# Altium schematic sheet NB3000_Top.SchDoc: NB3000 Top Level
size A2; Organization: Altium Limited.; DocumentNumber: 3; Revision: 1; SheetNumber: 1; SheetTotal: 106
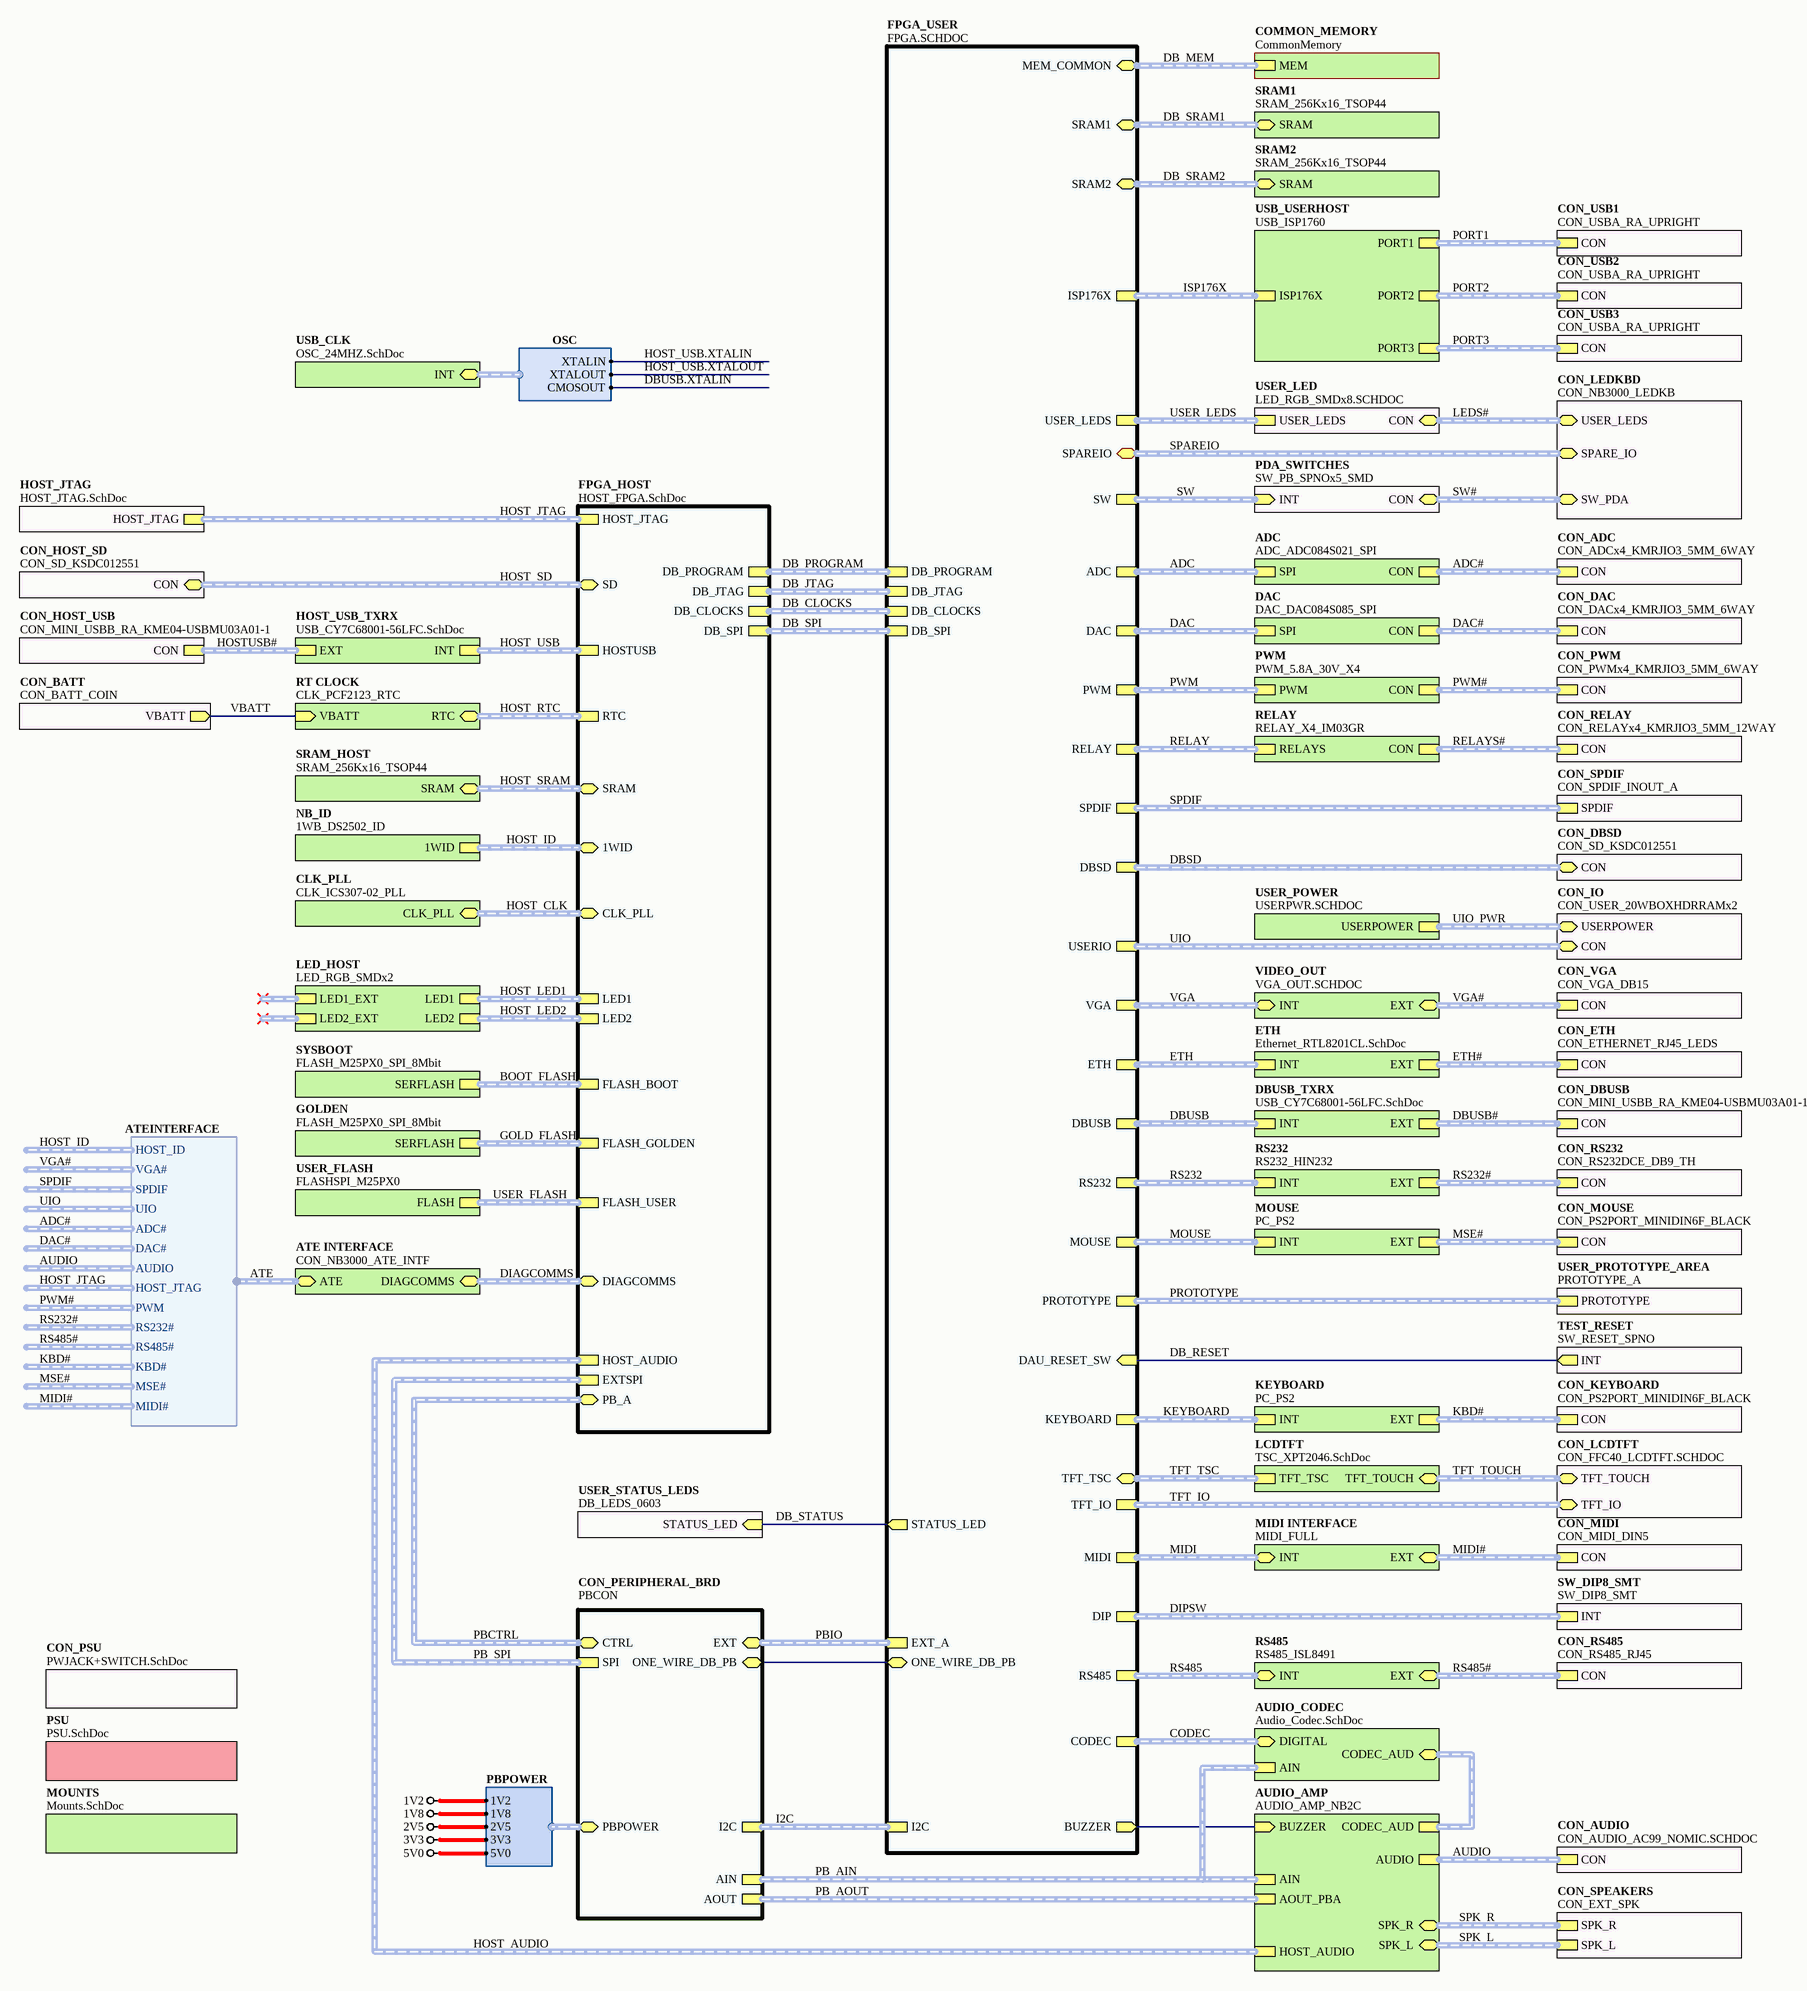
[diagram p0: NB3000_Top.SchDoc]

## Sub-sheets
ADC = ADC_ADC084S021_SPI: SPI (harness ADC_SPI), CON (harness ADC_CON)
ATE INTERFACE = CON_NB3000_ATE_INTF: ATE (harness ATEINTERFACE), DIAGCOMMS (harness DIAGCOMMS)
AUDIO_AMP = AUDIO_AMP_NB2C: BUZZER (in), CODEC_AUD (harness STEREO), AUDIO (harness AUDIO_EXT), SPK_L (harness SPEAKER), SPK_R (harness SPEAKER), HOST_AUDIO (harness STEREO), AIN (harness AUDIO_IN), AOUT_PBA (harness AUDIO_OUT)
AUDIO_CODEC = Audio_Codec.SchDoc: DIGITAL (harness AUDIO_DIGITAL), CODEC_AUD (harness STEREO), AIN (harness AUDIO_IN)
CLK_PLL = CLK_ICS307-02_PLL: CLK_PLL (harness CLK_PLL)
COMMON_MEMORY = CommonMemory: MEM (harness HOSTMEMORY)
CON_ADC = CON_ADCx4_KMRJIO3_5MM_6WAY: CON (harness ADC_CON)
CON_AUDIO = CON_AUDIO_AC99_NOMIC.SCHDOC: CON (harness AUDIO_EXT)
CON_BATT = CON_BATT_COIN: VBATT (out)
CON_DAC = CON_DACx4_KMRJIO3_5MM_6WAY: CON (harness DAC_CON)
CON_DBSD = CON_SD_KSDC012551: CON (harness SD)
CON_DBUSB = CON_MINI_USBB_RA_KME04-USBMU03A01-1: CON (harness USB_CON)
CON_ETH = CON_ETHERNET_RJ45_LEDS: CON (harness ETHERNET_CON)
CON_HOST_SD = CON_SD_KSDC012551: CON (harness SD)
CON_HOST_USB = CON_MINI_USBB_RA_KME04-USBMU03A01-1: CON (harness USB_CON)
CON_IO = CON_USER_20WBOXHDRRAMx2: CON (harness IO36), USERPOWER (harness USERPOWER)
CON_KEYBOARD = CON_PS2PORT_MINIDIN6F_BLACK: CON (harness PS2)
CON_LCDTFT = CON_FFC40_LCDTFT.SCHDOC: TFT_IO (harness TFT_IO), TFT_TOUCH (harness TFT_TOUCH)
CON_LEDKBD = CON_NB3000_LEDKB: USER_LEDS (harness User_LEDS), SW_PDA (harness SW5), SPARE_IO (harness SPAREIO)
CON_MIDI = CON_MIDI_DIN5: CON (harness MIDI_IO)
CON_MOUSE = CON_PS2PORT_MINIDIN6F_BLACK: CON (harness PS2)
CON_PERIPHERAL_BRD = PBCON: EXT (harness PBIO), ONE_WIRE_DB_PB (bidir), AIN (harness AUDIO_IN), I2C (harness I2C), SPI (harness EXTSPI), AOUT (harness AUDIO_OUT), CTRL (harness PBCTRL), PBPOWER (harness PBPOWER)
CON_PSU = PWJACK+SWITCH.SchDoc: no entries
CON_PWM = CON_PWMx4_KMRJIO3_5MM_6WAY: CON (harness PWM_CON)
CON_RELAY = CON_RELAYx4_KMRJIO3_5MM_12WAY: CON (harness RELAY_CON4)
CON_RS232 = CON_RS232DCE_DB9_TH: CON (harness RS232_EXT)
CON_RS485 = CON_RS485_RJ45: CON (harness RS485_EXT)
CON_SPDIF = CON_SPDIF_INOUT_A: SPDIF (harness SPDIF)
CON_SPEAKERS = CON_EXT_SPK: SPK_L (harness SPEAKER), SPK_R (harness SPEAKER)
CON_USB1 = CON_USBA_RA_UPRIGHT: CON (harness USB_CON)
CON_USB2 = CON_USBA_RA_UPRIGHT: CON (harness USB_CON)
CON_USB3 = CON_USBA_RA_UPRIGHT: CON (harness USB_CON)
CON_VGA = CON_VGA_DB15: CON (harness VGA_CON)
DAC = DAC_DAC084S085_SPI: SPI (harness DAC_SPI), CON (harness DAC_CON)
DBUSB_TXRX = USB_CY7C68001-56LFC.SchDoc: EXT (harness USB_CON), INT (harness USB_INTF)
ETH = Ethernet_RTL8201CL.SchDoc: INT (harness Ethernet), EXT (harness ETHERNET_CON)
FPGA_HOST = HOST_FPGA.SchDoc: HOST_JTAG (harness HARDSOFT_JTAG), LED1 (harness RGB_LED), LED2 (harness RGB_LED), 1WID (harness 1W), DB_PROGRAM (harness DAU_CTRL), CLK_PLL (harness CLK_PLL), FLASH_BOOT (harness SERFLASH), HOSTUSB (harness USB_INTF), SRAM (harness SRAM-256Kx16), RTC (harness RTC), SD (harness SD), HOST_AUDIO (harness STEREO), DB_JTAG (harness HARDSOFT_JTAG), DB_CLOCKS (harness DB_CLOCKS), FLASH_USER (harness SERIALFLASH), DB_SPI (harness DB_SPI), PB_A (harness PBCTRL), EXTSPI (harness EXTSPI), FLASH_GOLDEN (harness SERFLASH), DIAGCOMMS (harness DIAGCOMMS)
FPGA_USER = FPGA.SCHDOC: SRAM1 (harness SRAM-256Kx16), SRAM2 (harness SRAM-256Kx16), MEM_COMMON (harness HOSTMEMORY), DAU_RESET_SW (in), BUZZER (out), ONE_WIRE_DB_PB (bidir), SW (harness SW5), DIP (harness SW8), USERIO (harness IO36), EXT_A (harness PBIO), RS232 (harness RS232_INT), KEYBOARD (harness PS2), MOUSE (harness PS2), TFT_IO (harness TFT_IO), DB_PROGRAM (harness DAU_CTRL), STATUS_LED (out), USER_LEDS (harness USER_LEDS), RELAY (harness RELAY4), I2C (harness I2C), CODEC (harness AUDIO_DIGITAL), VGA (harness VGA), ETH (harness Ethernet), DBSD (harness SD), DBUSB (harness USB_INTF), PWM (harness PWM4), SPDIF (harness SPDIF), DAC (harness DAC_SPI), ADC (harness ADC_SPI), RS485 (harness RS485_INT), MIDI (harness MIDI_INT), DB_JTAG (harness HARDSOFT_JTAG), DB_CLOCKS (harness DB_CLOCKS), DB_SPI (harness DB_SPI), ISP176X (harness ISP176X), PROTOTYPE (harness IO36), SPAREIO (harness SPAREIO), TFT_TSC (harness TFT_TSC)
GOLDEN = FLASH_M25PX0_SPI_8Mbit: SERFLASH (harness SERFLASH)
HOST_JTAG = HOST_JTAG.SchDoc: HOST_JTAG (harness HARDSOFT_JTAG)
HOST_USB_TXRX = USB_CY7C68001-56LFC.SchDoc: EXT (harness USB_CON), INT (harness USB_INTF)
KEYBOARD = PC_PS2: EXT (harness PS2), INT (harness PS2)
LCDTFT = TSC_XPT2046.SchDoc: TFT_TSC (harness TFT_TSC), TFT_TOUCH (harness TFT_TOUCH)
LED_HOST = LED_RGB_SMDx2: LED1 (harness RGB_LED), LED2 (harness RGB_LED), LED1_EXT (harness RGB_LED), LED2_EXT (harness RGB_LED)
MIDI INTERFACE = MIDI_FULL: INT (harness MIDI_INT), EXT (harness MIDI_IO)
MOUNTS = Mounts.SchDoc: no entries
MOUSE = PC_PS2: EXT (harness PS2), INT (harness PS2)
NB_ID = 1WB_DS2502_ID: 1WID (harness 1W)
PDA_SWITCHES = SW_PB_SPNOx5_SMD: INT (harness SW5), CON (harness SW5)
PSU = PSU.SchDoc: no entries
PWM = PWM_5.8A_30V_X4: PWM (harness PWM4), CON (harness PWM_CON)
RELAY = RELAY_X4_IM03GR: RELAYS (harness RELAY4), CON (harness RELAY_CON4)
RS232 = RS232_HIN232: INT (harness RS232_INT), EXT (harness RS232_EXT)
RS485 = RS485_ISL8491: INT (harness RS485_INT), EXT (harness RS485_EXT)
RT CLOCK = CLK_PCF2123_RTC: VBATT (in), RTC (harness RTC)
SRAM1 = SRAM_256Kx16_TSOP44: SRAM (harness SRAM-256Kx16)
SRAM2 = SRAM_256Kx16_TSOP44: SRAM (harness SRAM-256Kx16)
SRAM_HOST = SRAM_256Kx16_TSOP44: SRAM (harness SRAM-256Kx16)
SW_DIP8_SMT = SW_DIP8_SMT: INT (harness SW8)
SYSBOOT = FLASH_M25PX0_SPI_8Mbit: SERFLASH (harness SERFLASH)
TEST_RESET = SW_RESET_SPNO: INT (out)
USB_CLK = OSC_24MHZ.SchDoc: INT (harness OSC)
USB_USERHOST = USB_ISP1760: ISP176X (harness ISP176X), PORT1 (harness USB_CON), PORT2 (harness USB_CON), PORT3 (harness USB_CON)
USER_FLASH = FLASHSPI_M25PX0: FLASH (harness SERIALFLASH)
USER_LED = LED_RGB_SMDx8.SCHDOC: USER_LEDS (harness USER_LEDS), CON (harness UseR_LEDS)
USER_POWER = USERPWR.SCHDOC: USERPOWER (harness USERPOWER)
USER_PROTOTYPE_AREA = PROTOTYPE_A: PROTOTYPE (harness IO36)
USER_STATUS_LEDS = DB_LEDS_0603: STATUS_LED (in)
VIDEO_OUT = VGA_OUT.SCHDOC: INT (harness VGA), EXT (harness VGA_CON)

## Harnesses
PBPOWER: 1V2, 1V8, 2V5, 3V3, 5V0
ATEINTERFACE: VGA#, SPDIF, UIO, ADC#, DAC#, AUDIO, HOST_JTAG, PWM, RS232#, RS485#, KBD#, MSE#, MIDI#, HOST_ID
OSC: CMOSOUT, XTALIN, XTALOUT

## Nets
1V2: sheet CON_PERIPHERAL_BRD/PBPOWER.1V2
1V8: sheet CON_PERIPHERAL_BRD/PBPOWER.1V8
2V5: sheet CON_PERIPHERAL_BRD/PBPOWER.2V5
3V3: sheet CON_PERIPHERAL_BRD/PBPOWER.3V3
5V0: sheet CON_PERIPHERAL_BRD/PBPOWER.5V0
DB_RESET: sheet FPGA_USER/DAU_RESET_SW, sheet TEST_RESET/INT
DB_STATUS: sheet USER_STATUS_LEDS/STATUS_LED, sheet FPGA_USER/STATUS_LED
DBUSB.XTALIN: sheet USB_CLK/INT.CMOSOUT
HOST_USB.XTALIN: sheet USB_CLK/INT.XTALIN
HOST_USB.XTALOUT: sheet USB_CLK/INT.XTALOUT
VBATT: sheet CON_BATT/VBATT, sheet RT CLOCK/VBATT
(unnamed): sheet FPGA_USER/BUZZER, sheet AUDIO_AMP/BUZZER
(unnamed): sheet FPGA_USER/ONE_WIRE_DB_PB, sheet CON_PERIPHERAL_BRD/ONE_WIRE_DB_PB

## Buses and harness runs
harness ADC = sheet ADC/SPI = sheet FPGA_USER/ADC
harness ADC# = sheet ADC/CON = sheet CON_ADC/CON
harness ATE = sheet ATE INTERFACE/ATE
harness AUDIO = sheet AUDIO_AMP/AUDIO = sheet CON_AUDIO/CON
harness BOOT_FLASH = sheet FPGA_HOST/FLASH_BOOT = sheet SYSBOOT/SERFLASH
harness CODEC = sheet AUDIO_CODEC/DIGITAL = sheet FPGA_USER/CODEC
harness DAC = sheet DAC/SPI = sheet FPGA_USER/DAC
harness DAC# = sheet CON_DAC/CON = sheet DAC/CON
harness DB_CLOCKS = sheet FPGA_HOST/DB_CLOCKS = sheet FPGA_USER/DB_CLOCKS
harness DB_JTAG = sheet FPGA_HOST/DB_JTAG = sheet FPGA_USER/DB_JTAG
harness DB_MEM = sheet COMMON_MEMORY/MEM = sheet FPGA_USER/MEM_COMMON
harness DB_PROGRAM = sheet FPGA_HOST/DB_PROGRAM = sheet FPGA_USER/DB_PROGRAM
harness DB_SPI = sheet FPGA_HOST/DB_SPI = sheet FPGA_USER/DB_SPI
harness DB_SRAM1 = sheet FPGA_USER/SRAM1 = sheet SRAM1/SRAM
harness DB_SRAM2 = sheet FPGA_USER/SRAM2 = sheet SRAM2/SRAM
harness DBSD = sheet CON_DBSD/CON = sheet FPGA_USER/DBSD
harness DBUSB = sheet DBUSB_TXRX/INT = sheet FPGA_USER/DBUSB
harness DBUSB# = sheet CON_DBUSB/CON = sheet DBUSB_TXRX/EXT
harness DIAGCOMMS = sheet ATE INTERFACE/DIAGCOMMS = sheet FPGA_HOST/DIAGCOMMS
harness DIPSW = sheet FPGA_USER/DIP = sheet SW_DIP8_SMT/INT
harness ETH = sheet ETH/INT = sheet FPGA_USER/ETH
harness ETH# = sheet CON_ETH/CON = sheet ETH/EXT
harness GOLD_FLASH = sheet FPGA_HOST/FLASH_GOLDEN = sheet GOLDEN/SERFLASH
harness HOST_AUDIO = sheet AUDIO_AMP/HOST_AUDIO = sheet FPGA_HOST/HOST_AUDIO
harness HOST_CLK = sheet CLK_PLL/CLK_PLL = sheet FPGA_HOST/CLK_PLL
harness HOST_ID = sheet FPGA_HOST/1WID = sheet NB_ID/1WID
harness HOST_JTAG = sheet FPGA_HOST/HOST_JTAG = sheet HOST_JTAG/HOST_JTAG
harness HOST_LED1 = sheet FPGA_HOST/LED1 = sheet LED_HOST/LED1
harness HOST_LED2 = sheet FPGA_HOST/LED2 = sheet LED_HOST/LED2
harness HOST_RTC = sheet FPGA_HOST/RTC = sheet RT CLOCK/RTC
harness HOST_SD = sheet CON_HOST_SD/CON = sheet FPGA_HOST/SD
harness HOST_SRAM = sheet FPGA_HOST/SRAM = sheet SRAM_HOST/SRAM
harness HOST_USB = sheet FPGA_HOST/HOSTUSB = sheet HOST_USB_TXRX/INT
harness HOSTUSB# = sheet CON_HOST_USB/CON = sheet HOST_USB_TXRX/EXT
harness I2C = sheet CON_PERIPHERAL_BRD/I2C = sheet FPGA_USER/I2C
harness ISP176X = sheet FPGA_USER/ISP176X = sheet USB_USERHOST/ISP176X
harness KBD# = sheet CON_KEYBOARD/CON = sheet KEYBOARD/EXT
harness KEYBOARD = sheet FPGA_USER/KEYBOARD = sheet KEYBOARD/INT
harness LEDS# = sheet CON_LEDKBD/USER_LEDS = sheet USER_LED/CON
harness MIDI = sheet FPGA_USER/MIDI = sheet MIDI INTERFACE/INT
harness MIDI# = sheet CON_MIDI/CON = sheet MIDI INTERFACE/EXT
harness MOUSE = sheet FPGA_USER/MOUSE = sheet MOUSE/INT
harness MSE# = sheet CON_MOUSE/CON = sheet MOUSE/EXT
harness PB_AIN = sheet AUDIO_AMP/AIN = sheet AUDIO_CODEC/AIN = sheet CON_PERIPHERAL_BRD/AIN
harness PB_AOUT = sheet AUDIO_AMP/AOUT_PBA = sheet CON_PERIPHERAL_BRD/AOUT
harness PB_SPI = sheet CON_PERIPHERAL_BRD/SPI = sheet FPGA_HOST/EXTSPI
harness PBCTRL = sheet CON_PERIPHERAL_BRD/CTRL = sheet FPGA_HOST/PB_A
harness PBIO = sheet CON_PERIPHERAL_BRD/EXT = sheet FPGA_USER/EXT_A
harness PORT1 = sheet CON_USB1/CON = sheet USB_USERHOST/PORT1
harness PORT2 = sheet CON_USB2/CON = sheet USB_USERHOST/PORT2
harness PORT3 = sheet CON_USB3/CON = sheet USB_USERHOST/PORT3
harness PROTOTYPE = sheet FPGA_USER/PROTOTYPE = sheet USER_PROTOTYPE_AREA/PROTOTYPE
harness PWM = sheet FPGA_USER/PWM = sheet PWM/PWM
harness PWM# = sheet CON_PWM/CON = sheet PWM/CON
harness RELAY = sheet FPGA_USER/RELAY = sheet RELAY/RELAYS
harness RELAYS# = sheet CON_RELAY/CON = sheet RELAY/CON
harness RS232 = sheet FPGA_USER/RS232 = sheet RS232/INT
harness RS232# = sheet CON_RS232/CON = sheet RS232/EXT
harness RS485 = sheet FPGA_USER/RS485 = sheet RS485/INT
harness RS485# = sheet CON_RS485/CON = sheet RS485/EXT
harness sheet AUDIO_AMP/CODEC_AUD = sheet AUDIO_CODEC/CODEC_AUD
harness SPAREIO = sheet CON_LEDKBD/SPARE_IO = sheet FPGA_USER/SPAREIO
harness SPDIF = sheet CON_SPDIF/SPDIF = sheet FPGA_USER/SPDIF
harness SPK_L = sheet AUDIO_AMP/SPK_L = sheet CON_SPEAKERS/SPK_L
harness SPK_R = sheet AUDIO_AMP/SPK_R = sheet CON_SPEAKERS/SPK_R
harness SW = sheet FPGA_USER/SW = sheet PDA_SWITCHES/INT
harness SW# = sheet CON_LEDKBD/SW_PDA = sheet PDA_SWITCHES/CON
harness TFT_IO = sheet CON_LCDTFT/TFT_IO = sheet FPGA_USER/TFT_IO
harness TFT_TOUCH = sheet CON_LCDTFT/TFT_TOUCH = sheet LCDTFT/TFT_TOUCH
harness TFT_TSC = sheet FPGA_USER/TFT_TSC = sheet LCDTFT/TFT_TSC
harness UIO = sheet CON_IO/CON = sheet FPGA_USER/USERIO
harness UIO_PWR = sheet CON_IO/USERPOWER = sheet USER_POWER/USERPOWER
harness USER_FLASH = sheet FPGA_HOST/FLASH_USER = sheet USER_FLASH/FLASH
harness USER_LEDS = sheet FPGA_USER/USER_LEDS = sheet USER_LED/USER_LEDS
harness VGA = sheet FPGA_USER/VGA = sheet VIDEO_OUT/INT
harness VGA# = sheet CON_VGA/CON = sheet VIDEO_OUT/EXT

## Notes on the sheet
- Project Title
- Sheet Title
- Size:
- Date:
- File:
- A2
- Assy:
- Time:
- Revision:
- Sheet
- of